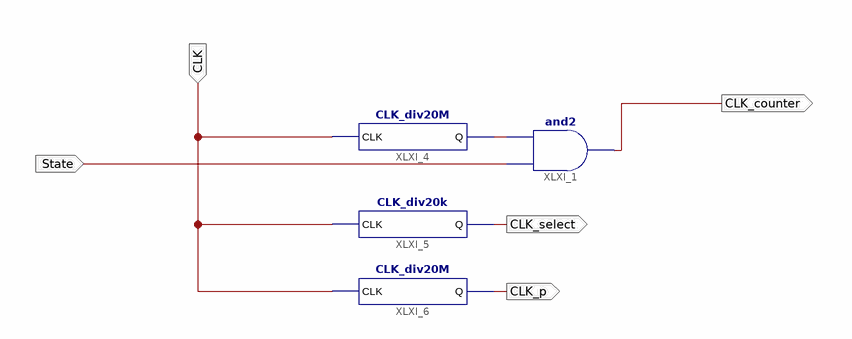
[diagram p0: schematic sheet 1]
// Xilinx ISE schematic CLK_divm.sch (spartan6) as structural Verilog: 4 symbols, 5 ports
module CLK_divm (
  input  State,
  input  CLK,
  output CLK_counter,
  output CLK_select,
  output CLK_p
);

  wire XLXN_1;

  and XLXI_1 (CLK_counter, State, XLXN_1);
  CLK_div20M XLXI_4 (.CLK(CLK), .Q(XLXN_1));
  CLK_div20k XLXI_5 (.CLK(CLK), .Q(CLK_select));
  CLK_div20M XLXI_6 (.CLK(CLK), .Q(CLK_p));
endmodule
